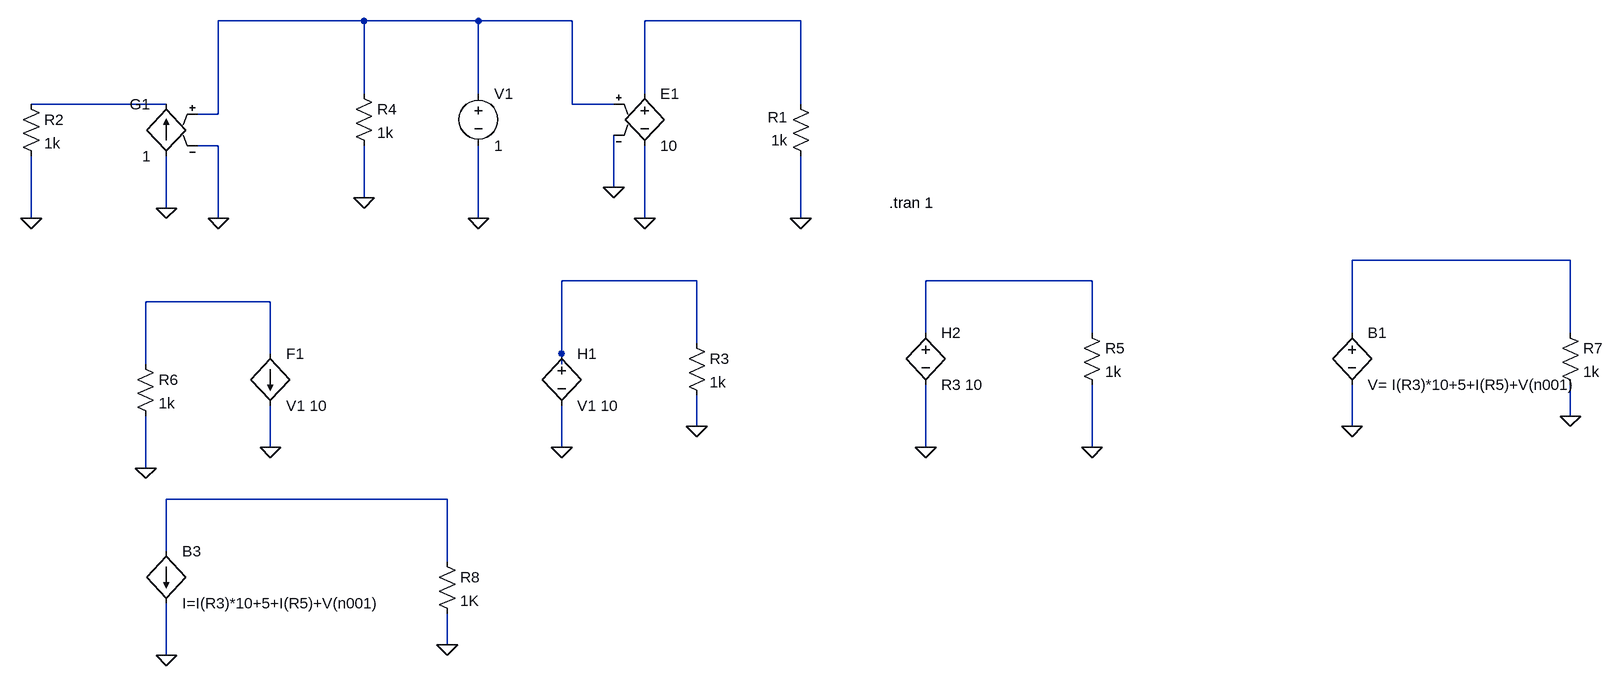
[diagram p0: schematic EP7.asc]
EP7.asc, the LTspice schematic file:
Version 4
SHEET 1 1648 980
WIRE -272 -16 -496 -16
WIRE -96 -16 -272 -16
WIRE 48 -16 -96 -16
WIRE 400 -16 160 -16
WIRE -272 96 -272 -16
WIRE -96 96 -96 -16
WIRE 160 96 160 -16
WIRE -576 112 -784 112
WIRE 48 112 48 -16
WIRE 112 112 48 112
WIRE 400 112 400 -16
WIRE -496 128 -496 -16
WIRE -496 128 -528 128
WIRE -496 176 -528 176
WIRE 112 240 112 160
WIRE -272 256 -272 176
WIRE -576 272 -576 192
WIRE -784 288 -784 192
WIRE -496 288 -496 176
WIRE -96 288 -96 176
WIRE 160 288 160 176
WIRE 400 288 400 192
WIRE 1584 352 1248 352
WIRE 240 384 32 384
WIRE 848 384 592 384
WIRE -416 416 -608 416
WIRE 592 464 592 384
WIRE 848 464 848 384
WIRE 1248 464 1248 352
WIRE 1584 464 1584 352
WIRE 240 480 240 384
WIRE -416 496 -416 416
WIRE 32 496 32 384
WIRE -608 512 -608 416
WIRE 32 512 32 496
WIRE 1584 592 1584 544
WIRE 240 608 240 560
WIRE 1248 608 1248 544
WIRE -416 640 -416 576
WIRE 32 640 32 576
WIRE 592 640 592 544
WIRE 848 640 848 544
WIRE -608 672 -608 592
WIRE -144 720 -576 720
WIRE -576 800 -576 720
WIRE -144 816 -144 720
WIRE -144 944 -144 896
WIRE -576 960 -576 880
FLAG -96 288 0
FLAG 160 288 0
FLAG 400 288 0
FLAG 112 240 0
FLAG -496 288 0
FLAG -784 288 0
FLAG 32 640 0
FLAG 240 608 0
FLAG -576 272 0
FLAG -272 256 0
FLAG 592 640 0
FLAG 848 640 0
FLAG -416 640 0
FLAG -608 672 0
FLAG 1248 608 0
FLAG 1584 592 0
FLAG -576 960 0
FLAG -144 944 0
SYMBOL e 160 80 R0
SYMATTR InstName E1
SYMATTR Value 10
SYMBOL voltage -96 80 R0
WINDOW 123 0 0 Left 0
WINDOW 39 0 0 Left 0
SYMATTR InstName V1
SYMATTR Value 1
SYMBOL res 416 208 R180
WINDOW 0 36 76 Left 2
WINDOW 3 36 40 Left 2
SYMATTR InstName R1
SYMATTR Value 1k
SYMBOL g -576 96 M0
SYMATTR InstName G1
SYMATTR Value 1
SYMBOL res -800 96 R0
SYMATTR InstName R2
SYMATTR Value 1k
SYMBOL h 32 480 R0
SYMATTR InstName H1
SYMATTR Value V1 10
SYMBOL res 224 464 R0
SYMATTR InstName R3
SYMATTR Value 1k
SYMBOL res -288 80 R0
SYMATTR InstName R4
SYMATTR Value 1k
SYMBOL h 592 448 R0
SYMATTR InstName H2
SYMATTR Value R3 10
SYMBOL res 832 448 R0
SYMATTR InstName R5
SYMATTR Value 1k
SYMBOL f -416 496 R0
SYMATTR InstName F1
SYMATTR Value V1 10
SYMBOL res -624 496 R0
SYMATTR InstName R6
SYMATTR Value 1k
SYMBOL bv 1248 448 R0
SYMATTR InstName B1
SYMATTR Value V= I(R3)*10+5+I(R5)+V(n001)
SYMBOL res 1568 448 R0
SYMATTR InstName R7
SYMATTR Value 1k
SYMBOL bi -576 800 R0
SYMATTR InstName B3
SYMATTR Value I=I(R3)*10+5+I(R5)+V(n001)
SYMBOL res -160 800 R0
SYMATTR InstName R8
SYMATTR Value 1K
TEXT 536 264 Left 2 !.tran 1

The netlist it stands for:
* EP7.asc
E1 N002 0 N001 0 10
V1 N001 0 1
R1 0 N002 1k
G1 0 N003 N001 0 1
R2 N003 0 1k
H1 N005 0 V1 10
R3 N005 0 1k
R4 N001 0 1k
H2 N006 0 R3 10
R5 N006 0 1k
F1 N007 0 V1 10
R6 N007 0 1k
B1 N004 0 V= I(R3)*10+5+I(R5)+V(n001)
R7 N004 0 1k
B3 N008 0 I=I(R3)*10+5+I(R5)+V(n001)
R8 N008 0 1K
.tran 1
.backanno
.end